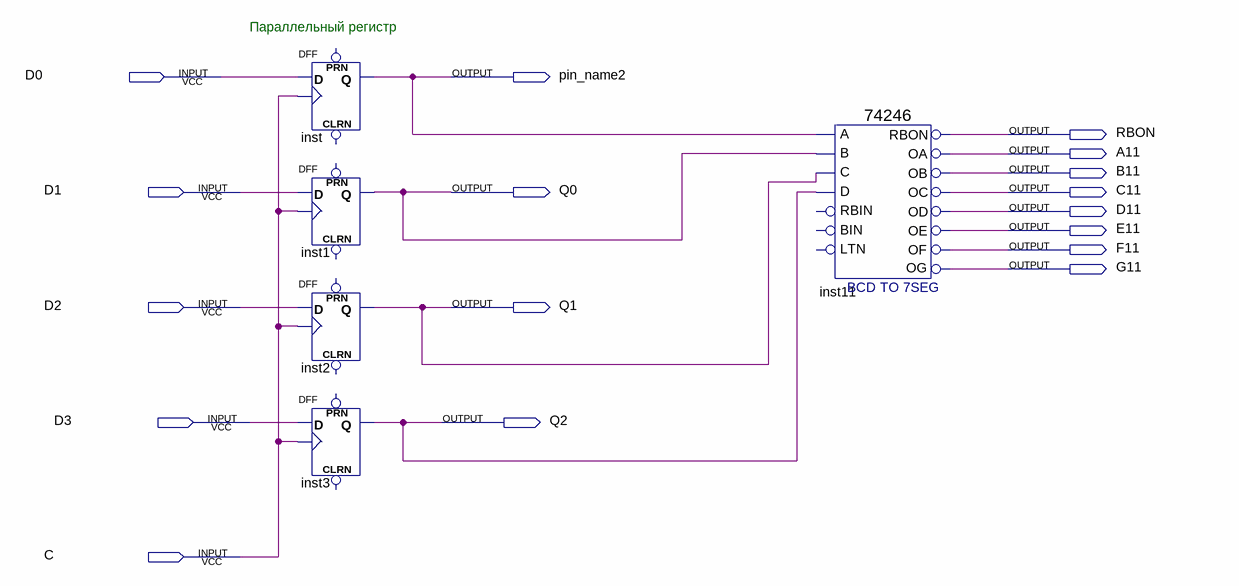
[diagram p0: schematic sheet]
// Quartus schematic Registers.bdf as structural Verilog: 5 symbols, 17 pins
module Registers (
  input  D0,
  input  D1,
  input  D2,
  input  D3,
  input  C,
  output pin_name2,
  output RBON,
  output A11,
  output B11,
  output Q0,
  output C11,
  output D11,
  output E11,
  output F11,
  output G11,
  output Q1,
  output Q2
);

  DFF inst (.CLK(C), .D(D0), .Q(pin_name2));  // open: CLRN, PRN
  DFF inst1 (.CLK(C), .D(D1), .Q(Q0));  // open: CLRN, PRN
  DFF inst2 (.CLK(C), .D(D2), .Q(Q1));  // open: CLRN, PRN
  DFF inst3 (.CLK(C), .D(D3), .Q(Q2));  // open: CLRN, PRN
  \74246  inst11 (
    .B(Q0), .A(pin_name2), .D(Q2), .C(Q1), .OD(D11), .RBON(RBON), .OC(C11), .OB(B11), .OE(E11), .OF(F11),
    .OA(A11), .OG(G11));  // open: RBIN, LTN, BIN

  // Notes on the sheet:
  //   Параллельный регистр
endmodule
